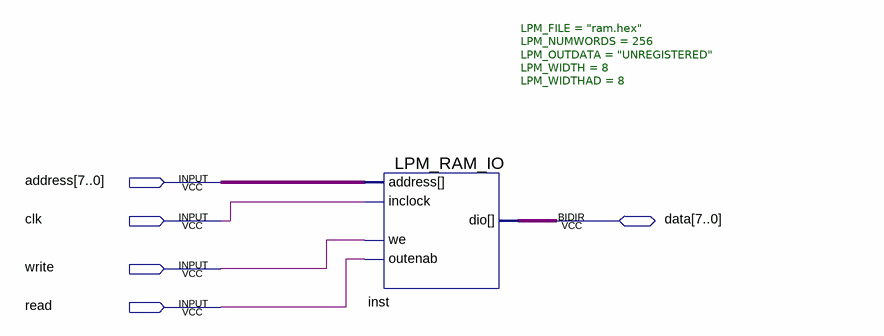
[diagram p0: schematic sheet]
// Quartus schematic ram.bdf as structural Verilog: 1 symbols, 5 pins
module ram (
  input  [7:0] address,
  input  clk,
  input  write,
  input  read,
  inout  [7:0] data
);

  LPM_RAM_IO #(.LPM_FILE("ram.hex"), .LPM_NUMWORDS(256), .LPM_OUTDATA("UNREGISTERED"), .LPM_WIDTH(8), .LPM_WIDTHAD(8)) inst (
    .address(address), .inclock(clk), .we(write), .outenab(read), .dio(data));
endmodule
